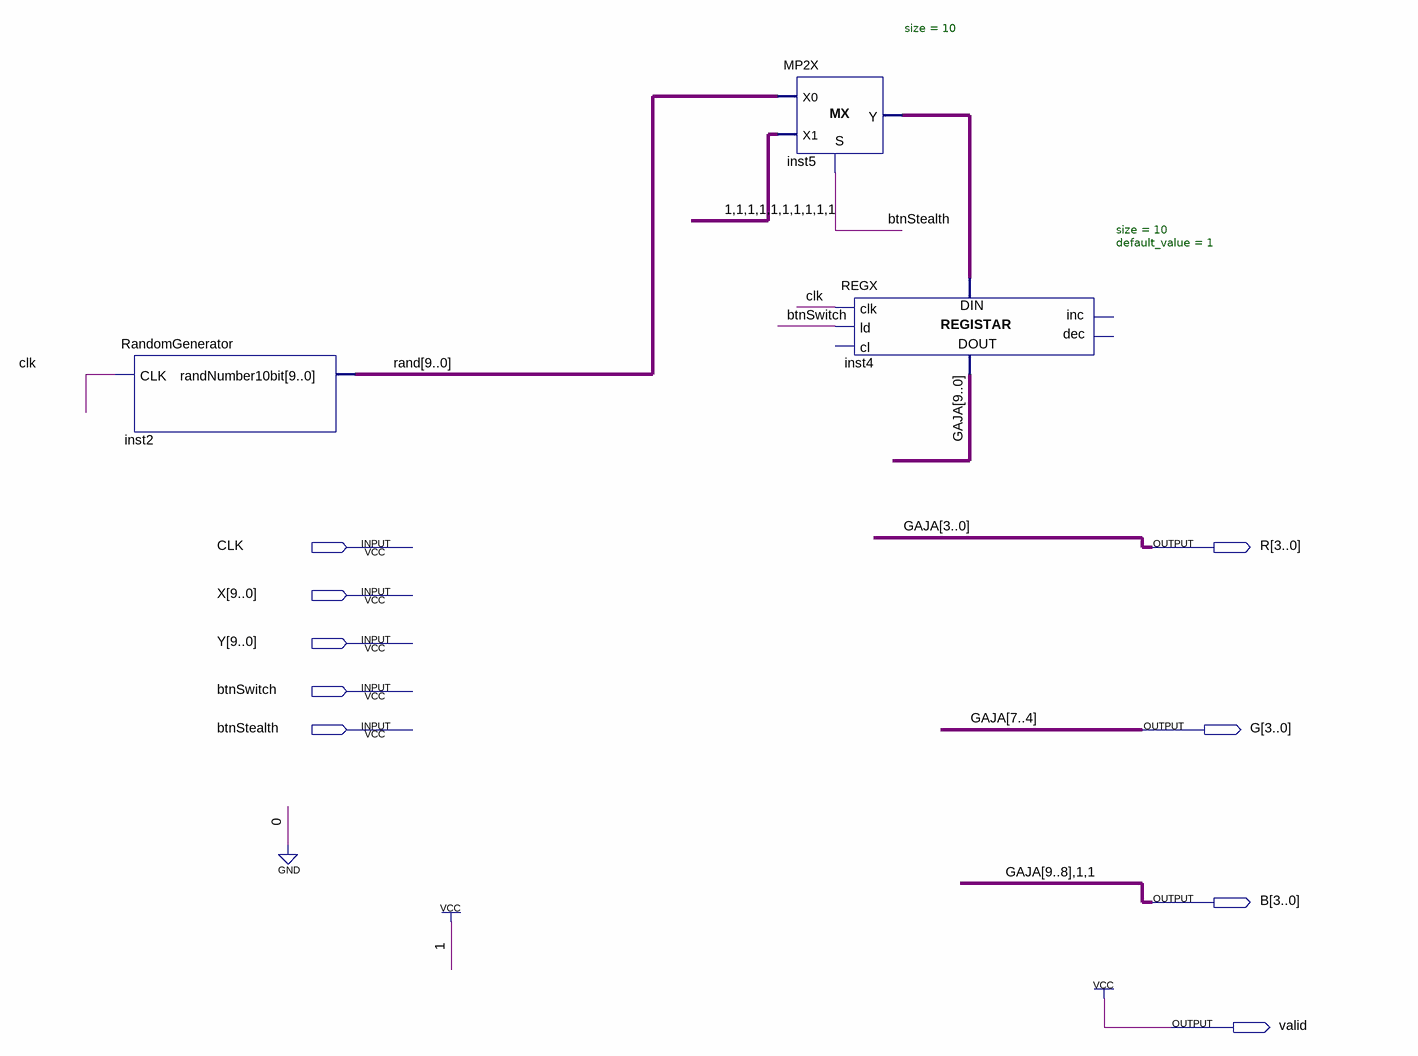
[diagram p0: schematic sheet]
// Quartus schematic Layer0.bdf as structural Verilog: 3 symbols, 9 pins
module Layer0 (
  input  CLK,
  input  [9:0] X,
  input  [9:0] Y,
  input  btnSwitch,
  input  btnStealth,
  output [3:0] R,
  output [3:0] G,
  output [3:0] B,
  output valid
);

  wire [9:0] inst5_y, \rand ;

  RandomGenerator inst2 (.CLK(CLK), .randNumber10bit(\rand ));
  MP2X #(.size(10)) inst5 (.S(btnStealth), .X0(\rand ), .X1({10{1'b1}}), .Y(inst5_y));
  REGX #(.size(10), .default_value(1)) inst4 (
    .clk(CLK), .ld(btnSwitch), .data_in(inst5_y), .data_out({B[3:2], G, R}));  // open: cl, inc, dec

  assign B[1:0] = 2'b11;
  assign valid = 1'b1;

  // Other names for the same wires on the sheet: GAJA[9:0] = {B[3:2], G, R}
endmodule
